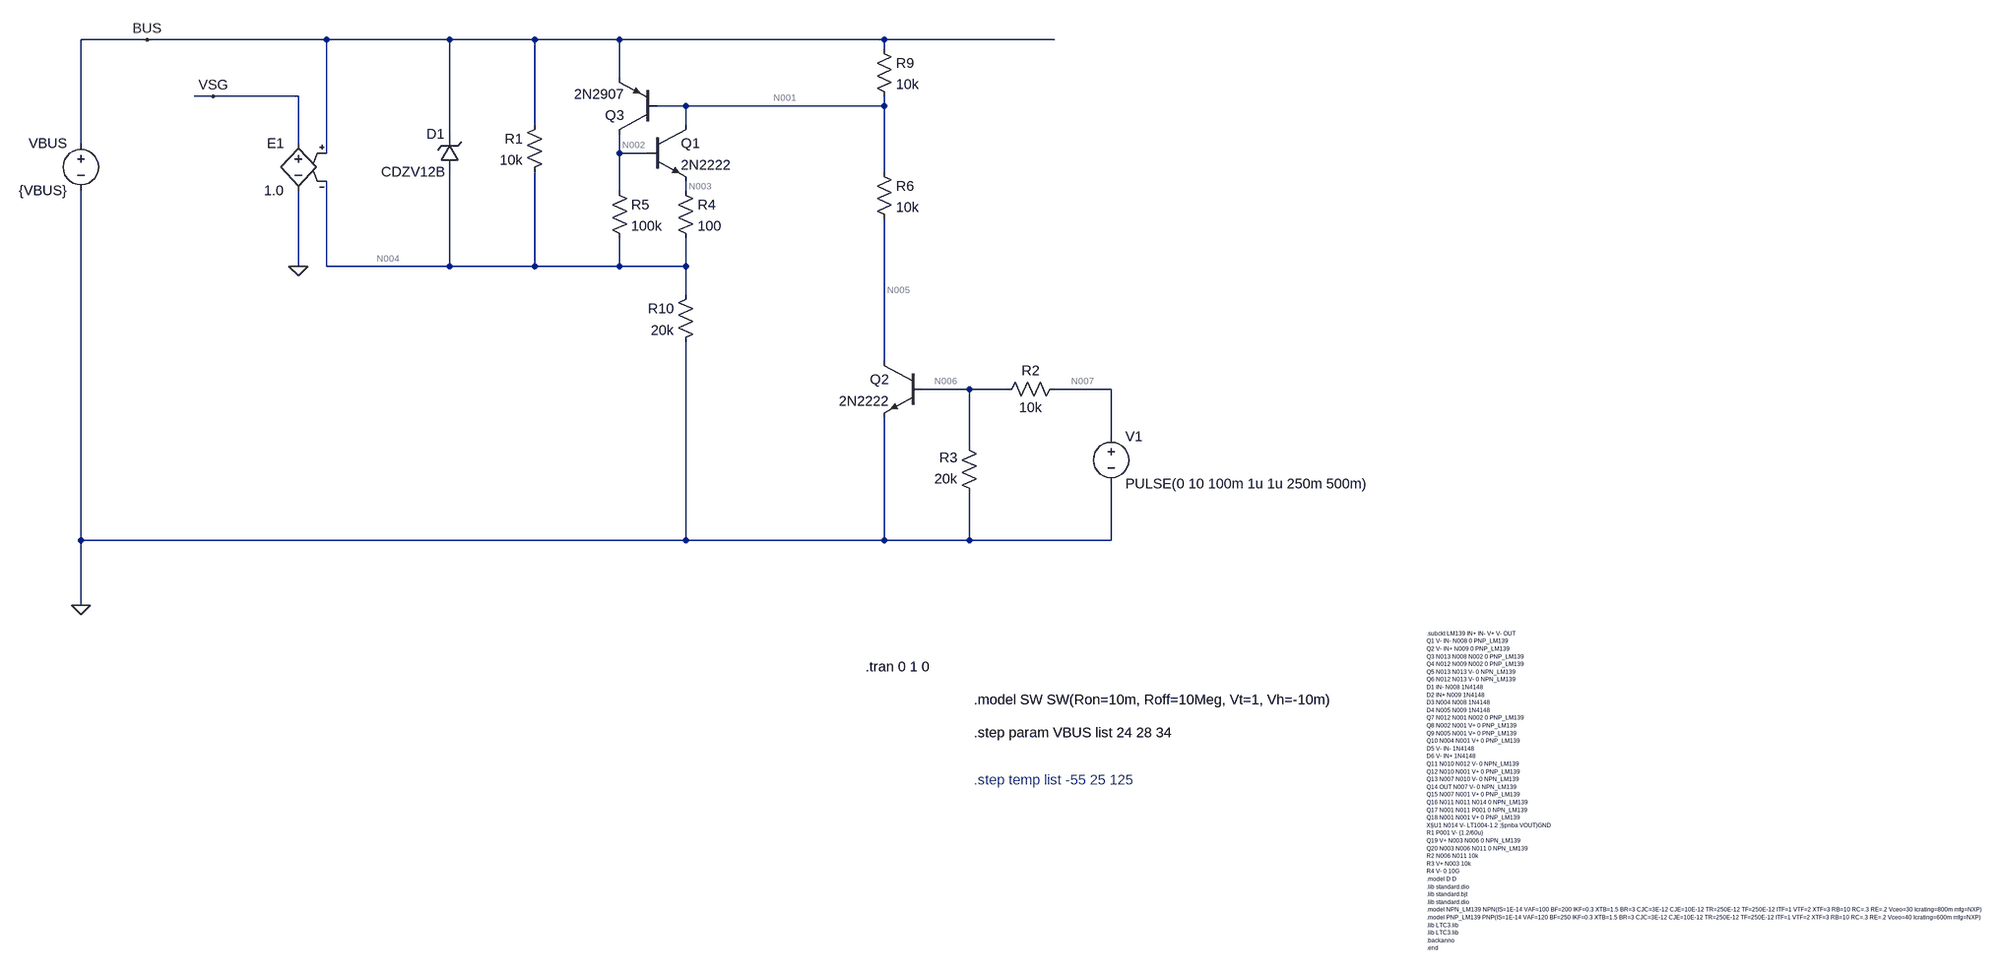
[diagram p0: schematic Latchoff_Circuit.asc]
Latchoff_Circuit.asc, the LTspice schematic file:
Version 4.1
SHEET 1 7892 3304
WIRE -4208 -1008 -4320 -1008
WIRE -3904 -1008 -4208 -1008
WIRE -3696 -1008 -3904 -1008
WIRE -3552 -1008 -3696 -1008
WIRE -3408 -1008 -3552 -1008
WIRE -2960 -1008 -3408 -1008
WIRE -2672 -1008 -2960 -1008
WIRE -2960 -992 -2960 -1008
WIRE -3408 -944 -3408 -1008
WIRE -4096 -912 -4128 -912
WIRE -3952 -912 -4096 -912
WIRE -3296 -896 -3344 -896
WIRE -2960 -896 -2960 -912
WIRE -2960 -896 -3296 -896
WIRE -3552 -864 -3552 -1008
WIRE -3296 -864 -3296 -896
WIRE -3696 -848 -3696 -1008
WIRE -4320 -832 -4320 -1008
WIRE -3952 -832 -3952 -912
WIRE -3904 -816 -3904 -1008
WIRE -3408 -816 -3408 -848
WIRE -3360 -816 -3408 -816
WIRE -2960 -784 -2960 -896
WIRE -3408 -752 -3408 -816
WIRE -3296 -752 -3296 -768
WIRE -3952 -624 -3952 -752
WIRE -3904 -624 -3904 -768
WIRE -3696 -624 -3696 -784
WIRE -3696 -624 -3904 -624
WIRE -3552 -624 -3552 -784
WIRE -3552 -624 -3696 -624
WIRE -3408 -624 -3408 -672
WIRE -3408 -624 -3552 -624
WIRE -3296 -624 -3296 -672
WIRE -3296 -624 -3408 -624
WIRE -3296 -576 -3296 -624
WIRE -2960 -464 -2960 -704
WIRE -2816 -416 -2896 -416
WIRE -2752 -416 -2816 -416
WIRE -2576 -416 -2672 -416
WIRE -2576 -336 -2576 -416
WIRE -2816 -320 -2816 -416
WIRE -4320 -160 -4320 -752
WIRE -3296 -160 -3296 -496
WIRE -3296 -160 -4320 -160
WIRE -2960 -160 -2960 -368
WIRE -2960 -160 -3296 -160
WIRE -2816 -160 -2816 -240
WIRE -2816 -160 -2960 -160
WIRE -2576 -160 -2576 -256
WIRE -2576 -160 -2816 -160
WIRE -4320 -48 -4320 -160
FLAG -4320 -48 0
FLAG -4208 -1008 BUS
FLAG -4096 -912 VSG
FLAG -3952 -624 0
SYMBOL voltage -4320 -848 M0
WINDOW 123 0 0 Left 0
WINDOW 39 0 0 Left 0
SYMATTR InstName VBUS
SYMATTR Value {VBUS}
SYMBOL res -2976 -1008 R0
SYMATTR InstName R9
SYMATTR Value 10k
SYMBOL res -3280 -592 M0
SYMATTR InstName R10
SYMATTR Value 20k
SYMBOL npn -3360 -864 R0
SYMATTR InstName Q1
SYMATTR Value 2N2222
SYMBOL pnp -3344 -848 R180
SYMATTR InstName Q3
SYMATTR Value 2N2907
SYMBOL res -3536 -880 M0
SYMATTR InstName R1
SYMATTR Value 10k
SYMBOL zener -3680 -784 R180
WINDOW 0 24 64 Left 2
WINDOW 3 24 0 Left 2
SYMATTR InstName D1
SYMATTR Value CDZV12B
SYMBOL e -3952 -848 M0
SYMATTR InstName E1
SYMATTR Value 1.0
SYMBOL voltage -2576 -352 R0
WINDOW 123 0 0 Left 0
WINDOW 39 0 0 Left 0
SYMATTR InstName V1
SYMATTR Value PULSE(0 10 100m 1u 1u 250m 500m)
SYMBOL npn -2896 -464 M0
SYMATTR InstName Q2
SYMATTR Value 2N2222
SYMBOL res -2656 -432 R90
WINDOW 0 0 56 VBottom 2
WINDOW 3 32 56 VTop 2
SYMATTR InstName R2
SYMATTR Value 10k
SYMBOL res -2800 -224 R180
WINDOW 0 36 76 Left 2
WINDOW 3 36 40 Left 2
SYMATTR InstName R3
SYMATTR Value 20k
SYMBOL res -3312 -768 R0
SYMATTR InstName R4
SYMATTR Value 100
SYMBOL res -3424 -768 R0
SYMATTR InstName R5
SYMATTR Value 100k
SYMBOL res -2976 -800 R0
SYMATTR InstName R6
SYMATTR Value 10k
TEXT -2992 56 Left 2 !.tran 0 1 0
TEXT -2808 112 Left 2 !.model SW SW(Ron=10m, Roff=10Meg, Vt=1, Vh=-10m)
TEXT -2808 168 Left 2 !.step param VBUS list 24 28 34
TEXT -2040 0 Left 0 !.subckt LM139 IN+ IN- V+ V- OUT\nQ1 V- IN- N008 0 PNP_LM139\nQ2 V- IN+ N009 0 PNP_LM139\nQ3 N013 N008 N002 0 PNP_LM139\nQ4 N012 N009 N002 0 PNP_LM139\nQ5 N013 N013 V- 0 NPN_LM139\nQ6 N012 N013 V- 0 NPN_LM139\nD1 IN- N008 1N4148\nD2 IN+ N009 1N4148\nD3 N004 N008 1N4148\nD4 N005 N009 1N4148\nQ7 N012 N001 N002 0 PNP_LM139\nQ8 N002 N001 V+ 0 PNP_LM139\nQ9 N005 N001 V+ 0 PNP_LM139\nQ10 N004 N001 V+ 0 PNP_LM139\nD5 V- IN- 1N4148\nD6 V- IN+ 1N4148\nQ11 N010 N012 V- 0 NPN_LM139\nQ12 N010 N001 V+ 0 PNP_LM139\nQ13 N007 N010 V- 0 NPN_LM139\nQ14 OUT N007 V- 0 NPN_LM139\nQ15 N007 N001 V+ 0 PNP_LM139\nQ16 N011 N011 N014 0 NPN_LM139\nQ17 N001 N011 P001 0 NPN_LM139\nQ18 N001 N001 V+ 0 PNP_LM139\nX§U1 N014 V- LT1004-1.2 ;§pnba VOUT)GND\nR1 P001 V- {1.2/60u}\nQ19 V+ N003 N006 0 NPN_LM139\nQ20 N003 N006 N011 0 NPN_LM139\nR2 N006 N011 10k\nR3 V+ N003 10k\nR4 V- 0 10G\n.model D D\n.lib standard.dio\n.lib standard.bjt\n.lib standard.dio\n.model NPN_LM139 NPN(IS=1E-14 VAF=100 BF=200 IKF=0.3 XTB=1.5 BR=3 CJC=3E-12 CJE=10E-12 TR=250E-12 TF=250E-12 ITF=1 VTF=2 XTF=3 RB=10 RC=.3 RE=.2 Vceo=30 Icrating=800m mfg=NXP)\n.model PNP_LM139 PNP(IS=1E-14 VAF=120 BF=250 IKF=0.3 XTB=1.5 BR=3 CJC=3E-12 CJE=10E-12 TR=250E-12 TF=250E-12 ITF=1 VTF=2 XTF=3 RB=10 RC=.3 RE=.2 Vceo=40 Icrating=600m mfg=NXP)\n.lib LTC3.lib\n.lib LTC3.lib\n.backanno\n.end
TEXT -2808 248 Left 2 ;.step temp list -55 25 125

The netlist it stands for:
* Latchoff_Circuit.asc
VBUS BUS 0 {VBUS}
R9 BUS N001 10k
R10 N004 0 20k
Q1 N001 N002 N003 0 2N2222
Q3 N002 N001 BUS 0 2N2907
R1 BUS N004 10k
D1 N004 BUS CDZV12B
E1 VSG 0 BUS N004 1.0
V1 N007 0 PULSE(0 10 100m 1u 1u 250m 500m)
Q2 N005 N006 0 0 2N2222
R2 N007 N006 10k
R3 0 N006 20k
R4 N003 N004 100
R5 N002 N004 100k
R6 N001 N005 10k
.model D D
.lib standard.dio
.model NPN NPN
.model PNP PNP
.lib standard.bjt
.tran 0 1 0
.model SW SW(Ron=10m, Roff=10Meg, Vt=1, Vh=-10m)
.step param VBUS list 24 28 34
.subckt LM139 IN+ IN- V+ V- OUT
Q1 V- IN- N008 0 PNP_LM139
Q2 V- IN+ N009 0 PNP_LM139
Q3 N013 N008 N002 0 PNP_LM139
Q4 N012 N009 N002 0 PNP_LM139
Q5 N013 N013 V- 0 NPN_LM139
Q6 N012 N013 V- 0 NPN_LM139
D1 IN- N008 1N4148
D2 IN+ N009 1N4148
D3 N004 N008 1N4148
D4 N005 N009 1N4148
Q7 N012 N001 N002 0 PNP_LM139
Q8 N002 N001 V+ 0 PNP_LM139
Q9 N005 N001 V+ 0 PNP_LM139
Q10 N004 N001 V+ 0 PNP_LM139
D5 V- IN- 1N4148
D6 V- IN+ 1N4148
Q11 N010 N012 V- 0 NPN_LM139
Q12 N010 N001 V+ 0 PNP_LM139
Q13 N007 N010 V- 0 NPN_LM139
Q14 OUT N007 V- 0 NPN_LM139
Q15 N007 N001 V+ 0 PNP_LM139
Q16 N011 N011 N014 0 NPN_LM139
Q17 N001 N011 P001 0 NPN_LM139
Q18 N001 N001 V+ 0 PNP_LM139
X§U1 N014 V- LT1004-1.2 ;§pnba VOUT)GND
R1 P001 V- {1.2/60u}
Q19 V+ N003 N006 0 NPN_LM139
Q20 N003 N006 N011 0 NPN_LM139
R2 N006 N011 10k
R3 V+ N003 10k
R4 V- 0 10G
.model D D
.lib standard.dio
.lib standard.bjt
.lib standard.dio
.model NPN_LM139 NPN(IS=1E-14 VAF=100 BF=200 IKF=0.3 XTB=1.5 BR=3 CJC=3E-12 CJE=10E-12 TR=250E-12 TF=250E-12 ITF=1 VTF=2 XTF=3 RB=10 RC=.3 RE=.2 Vceo=30 Icrating=800m mfg=NXP)
.model PNP_LM139 PNP(IS=1E-14 VAF=120 BF=250 IKF=0.3 XTB=1.5 BR=3 CJC=3E-12 CJE=10E-12 TR=250E-12 TF=250E-12 ITF=1 VTF=2 XTF=3 RB=10 RC=.3 RE=.2 Vceo=40 Icrating=600m mfg=NXP)
.lib LTC3.lib
.lib LTC3.lib
.backanno
.end
* .step temp list -55 25 125
.backanno
.end